# Altium project 示波器.PrjPcb
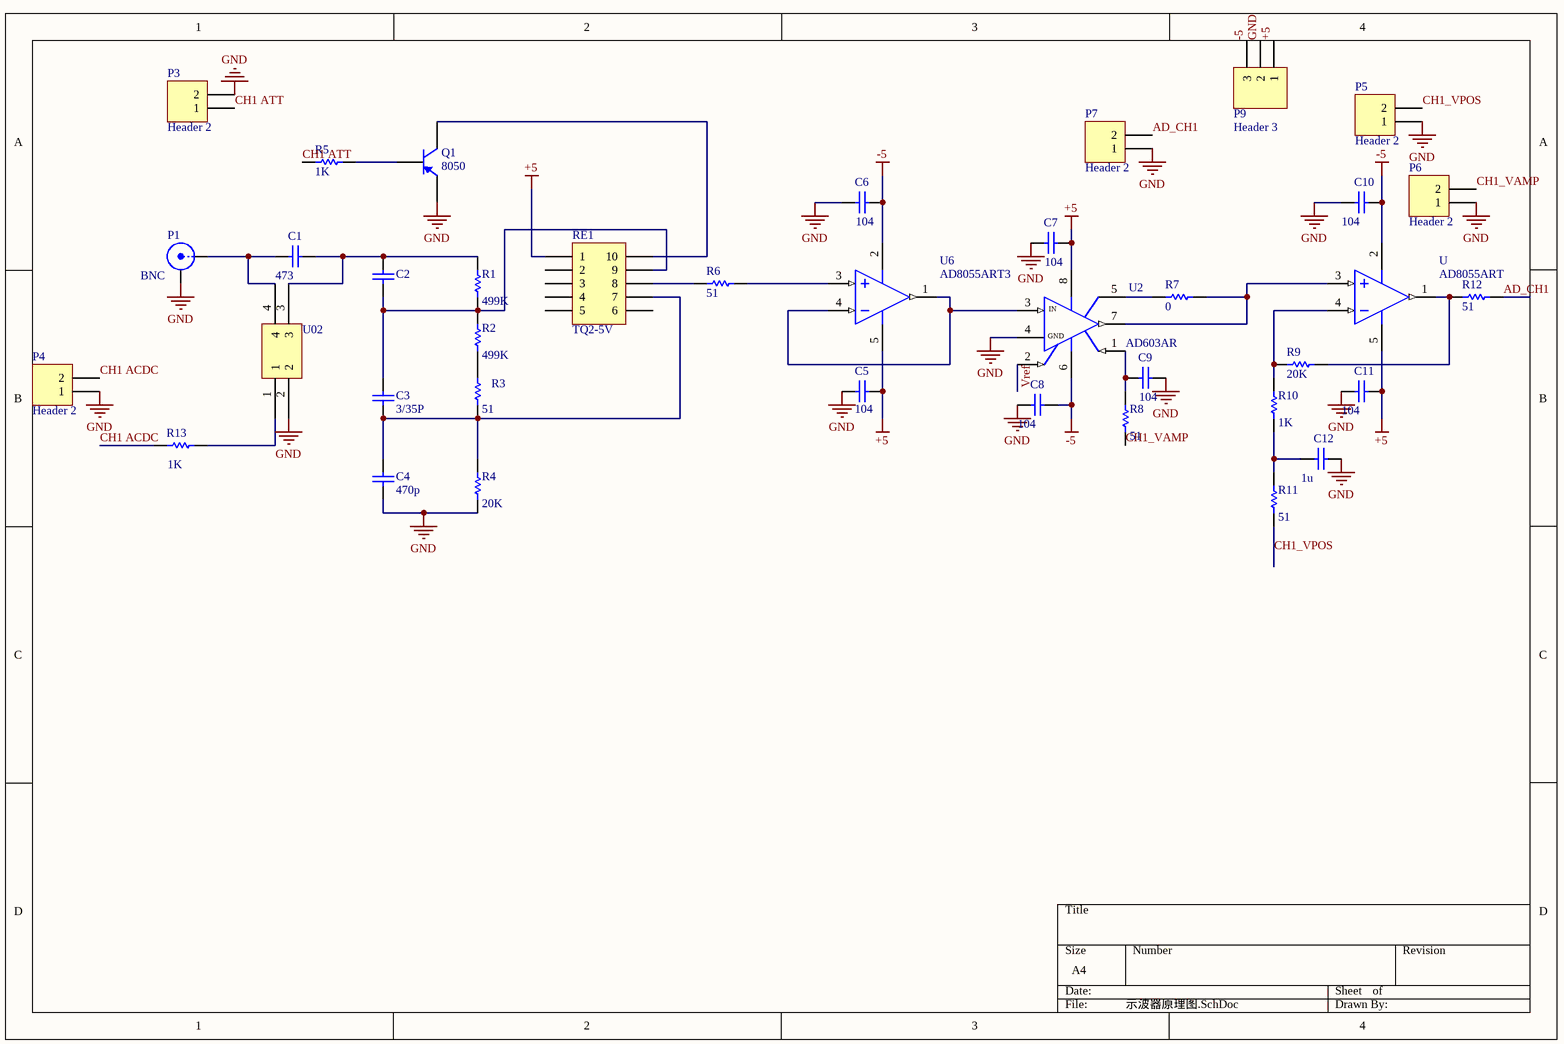
[diagram p0: 示波器原理图.SchDoc]
5 sheets, 129 parts. Net scope: global (net labels, ports and power ports of the same name join across sheets).
Board file: new示波器pcb.PcbDoc
Sheets:
  示波器原理图.SchDoc
  示波器原理图2.SchDoc
  示波器原理图6.SchDoc
  示波器原理图3.SchDoc
  示波器原理图5.SchDoc

## Sheet 示波器原理图.SchDoc
size A4

### Parts
C1  value 473  [PCBComponent_1]
C2  (no value)  [PCBComponent_1]
C3  value 3/35P  [PCBComponent_1]
C4  value 470p  [PCBComponent_1]
C5  value 104  [PCBComponent_1]
C6  104  [PCBComponent_1]
C7  value 104  [PCBComponent_1]
C8  value 104  [PCBComponent_1]
C9  value 104  [PCBComponent_1]
C10  value 104  [PCBComponent_1]
C11  value 104  [PCBComponent_1]
C12  value 1u  [PCBComponent_1]
P1  BNC  [BNC_RA CON]
P3  Header 2  [HDR1X2]
P4  Header 2  [HDR1X2]
P5  Header 2  [HDR1X2]
P6  Header 2  [HDR1X2]
P7  Header 2  [HDR1X2]
P9  Header 3  [HDR1X3]
Q1  8050  [PCBComponent_1]
R1  value 499K  [PCBComponent_1]
R2  value 499K  [PCBComponent_1]
R3  value 51  [PCBComponent_1]
R4  value 20K  [2012[0805]]
R5  value 1K  [PCBComponent_1]
R6  value 51  [PCBComponent_1]
R7  value 0  [2012[0805]]
R8  value 51  [2012[0805]]
R9  value 20K  [2012[0805]]
R10  value 1K  [2012[0805]]
R11  value 51  [2012[0805]]
R12  value 51  [2012[0805]]
R13  value 1K  [PCBComponent_1]
RE1  TQ2-5V  [PCBComponent_1]
U  AD8055ART  [SOT95P245X110-5N]
U2  AD603AR  [SOIC127P600X175-8N]
U02  (no value)  [SOP254P610X218-4N]
U6  AD8055ART3  [SOT95P245X110-5N]

### Nets
+5: C5.1 C7.2 C11.2 P9.1 RE1.1 U.5(V+) U2.8(V+) U6.5(V+)
-5: C6.1 C8.2 C10.2 P9.3 U.2(V-) U2.6(V-) U6.2(V-)
GND: C4.1 C5.2 C6.2 C7.1 C8.1 C9.2 C10.1 C11.1 C12.2 P1.2(Y) P3.2 P4.1 P5.1 P6.1 P7.1 P9.2 Q1.1(E) R4.1 U02.2 U2.4(COMM)
AD_CH1: P7.2 R12.1
CH1 ACDC: P4.2 R13.1
CH1 ATT: P3.1 R5.2
CH1_VAMP: P6.2 R8.1
CH1_VPOS: P5.2 R11.1
Vref: U2.2(G-)
NetC1_1: C1.1 P1.1(X) U02.4
NetC1_2: C1.2 C2.2 R1.2 U02.3
NetC2_1: C2.1 C3.2 R1.1 R2.2 RE1.9
NetC3_1: C3.1 C4.2 R3.1 R4.2 RE1.7
NetC9_1: C9.1 R8.2 U2.1(G+)
NetC12_1: C12.1 R10.1 R11.2
NetQ1_2: Q1.2(B) R5.1
NetQ1_3: Q1.3(C) RE1.10
NetR2_1: R2.1 R3.2
NetR6_1: R6.1 U6.3(IN+)
NetR6_2: R6.2 RE1.8
NetR7_1: R7.1 U.3(IN+) U2.7(VOUT)
NetR7_2: R7.2 U2.5(FDBK)
NetR9_1: R9.1 R12.2 U.1(OUT)
NetR9_2: R9.2 R10.2 U.4(IN-)
NetR13_2: R13.2 U02.1
NetU2_3: U2.3(VINP) U6.1(OUT) U6.4(IN-)

Not connected (* = marked no-connect by the designer): RE1 2 3 4 5 6

### Notes on the sheet
- (in symbol AD603AR) IN; GND

### Library data of the parts
C1-C12 = Cap: Capacitor; Published: 8-Jun-2000; LatestRevisionDate: 17-Jul-2002; LatestRevisionNote: Re-released for DXP Platform.; PackageReference: RAD-0.3; Publisher: Altium Limited
P1 = BNC: BNC Elbow Connector; LatestRevisionDate: 17-Jul-2002; LatestRevisionNote: Re-released for DXP Platform.; Publisher: Altium Limited
P3-P7 = Header 2: Header, 2-Pin; LatestRevisionDate: 17-Jul-2002; LatestRevisionNote: Re-released for DXP Platform.; Publisher: Altium Limited
P9 = Header 3: Header, 3-Pin; LatestRevisionDate: 17-Jul-2002; LatestRevisionNote: Re-released for DXP Platform.; Publisher: Altium Limited
Q1 = 2N3906: PNP General Purpose Amplifier; Published: 8-Jun-2000; LatestRevisionDate: 15-Jan-2003; LatestRevisionNote: PCB Footprint 'BCY-W3/D4.7' replaced; DatasheetDocument: 1997; PackageDocument: Sep-1998; PackageReference: TO-92A; Publisher: Altium Limited; Code_JEDEC: TO-92A; ComponentLink1Description: Manufacturer Link; ComponentLink1URL: http://www.fairchildsemi.com/; ComponentLink2Description: Datasheet; ComponentLink2URL: http://www.fairchildsemi.com/ds/2N%2F2N3906.pdf
R1-R3 R5 R6 R13 = Res1: Resistor; Published: 8-Jun-2000; LatestRevisionDate: 17-Jul-2002; LatestRevisionNote: Re-released for DXP Platform.; PackageReference: AXIAL-0.3; Publisher: Altium Limited
R4 R7-R12 = Res Semi: Semiconductor Resistor; Published: 8-Jun-2000; LatestRevisionDate: 17-Jul-2002; LatestRevisionNote: Re-released for DXP Platform.; PackageReference: AXIAL-0.5; Publisher: Altium Limited
RE1 U02 = Component_1
U U6 = AD8055ART: Low Cost, 300MHz Voltage Feedback Amplifier; Text Field7: Published 8-Jun-2000
U2 = AD603AR: Low-Noise, 90MHz Variable Gain Amplifier; Text Field7: Published 8-Jun-2000, Modified 10-July-2000: SIM Model Added.

## Sheet 示波器原理图2.SchDoc
size A4
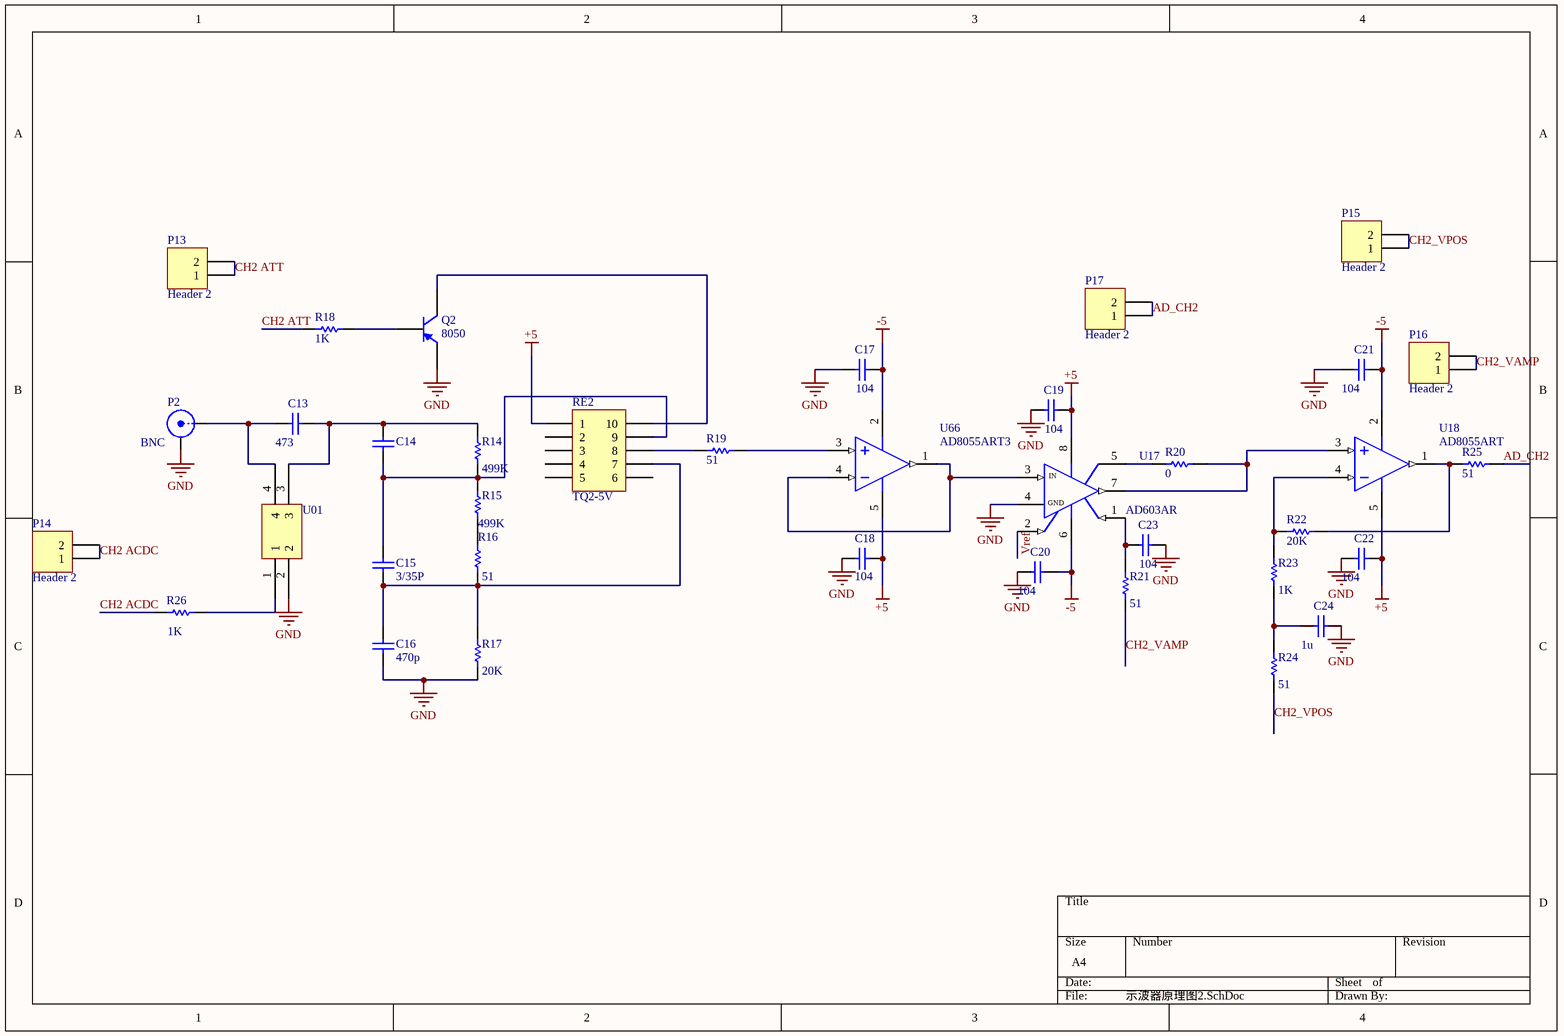
[diagram p1: 示波器原理图2.SchDoc]

### Parts
C13  value 473  [PCBComponent_1]
C14  (no value)  [PCBComponent_1]
C15  value 3/35P  [PCBComponent_1]
C16  value 470p  [PCBComponent_1]
C17  104  [PCBComponent_1]
C18  value 104  [PCBComponent_1]
C19  value 104  [PCBComponent_1]
C20  value 104  [PCBComponent_1]
C21  value 104  [PCBComponent_1]
C22  value 104  [PCBComponent_1]
C23  value 104  [PCBComponent_1]
C24  value 1u  [PCBComponent_1]
P2  BNC  [BNC_RA CON]
P13  Header 2  [HDR1X2]
P14  Header 2  [HDR1X2]
P15  Header 2  [HDR1X2]
P16  Header 2  [HDR1X2]
P17  Header 2  [HDR1X2]
Q2  8050  [PCBComponent_1]
R14  value 499K  [PCBComponent_1]
R15  value 499K  [PCBComponent_1]
R16  value 51  [PCBComponent_1]
R17  value 20K  [2012[0805]]
R18  value 1K  [PCBComponent_1]
R19  value 51  [PCBComponent_1]
R20  value 0  [2012[0805]]
R21  value 51  [2012[0805]]
R22  value 20K  [2012[0805]]
R23  value 1K  [2012[0805]]
R24  value 51  [2012[0805]]
R25  value 51  [2012[0805]]
R26  value 1K  [PCBComponent_1]
RE2  TQ2-5V  [PCBComponent_1]
U01  (no value)  [SOP254P610X218-4N]
U17  AD603AR  [SOIC127P600X175-8N]
U18  AD8055ART  [SOT95P245X110-5N]
U66  AD8055ART3  [SOT95P245X110-5N]

### Nets
+5: C18.1 C19.2 C22.2 RE2.1 U17.8(V+) U18.5(V+) U66.5(V+)
-5: C17.1 C20.2 C21.2 U17.6(V-) U18.2(V-) U66.2(V-)
GND: C16.1 C17.2 C18.2 C19.1 C20.1 C21.1 C22.1 C23.2 C24.2 P2.2(Y) Q2.1(E) R17.1 U01.2 U17.4(COMM)
AD_CH2: P17.1 P17.2 R25.1
CH2 ACDC: P14.1 P14.2 R26.1
CH2 ATT: P13.1 P13.2 R18.2
CH2_VAMP: P16.1 P16.2 R21.1
CH2_VPOS: P15.1 P15.2 R24.1
Vref: U17.2(G-)
NetC13_1: C13.1 P2.1(X) U01.4
NetC13_2: C13.2 C14.2 R14.2 U01.3
NetC14_1: C14.1 C15.2 R14.1 R15.2 RE2.9
NetC15_1: C15.1 C16.2 R16.1 R17.2 RE2.7
NetC23_1: C23.1 R21.2 U17.1(G+)
NetC24_1: C24.1 R23.1 R24.2
NetQ2_2: Q2.2(B) R18.1
NetQ2_3: Q2.3(C) RE2.10
NetR15_1: R15.1 R16.2
NetR19_1: R19.1 U66.3(IN+)
NetR19_2: R19.2 RE2.8
NetR20_1: R20.1 U17.7(VOUT) U18.3(IN+)
NetR20_2: R20.2 U17.5(FDBK)
NetR22_1: R22.1 R25.2 U18.1(OUT)
NetR22_2: R22.2 R23.2 U18.4(IN-)
NetR26_2: R26.2 U01.1
NetU17_3: U17.3(VINP) U66.1(OUT) U66.4(IN-)

Not connected (* = marked no-connect by the designer): RE2 2 3 4 5 6

### Notes on the sheet
- (in symbol AD603AR) IN; GND

### Library data of the parts
C13-C24 = Cap: Capacitor; Published: 8-Jun-2000; LatestRevisionDate: 17-Jul-2002; LatestRevisionNote: Re-released for DXP Platform.; PackageReference: RAD-0.3; Publisher: Altium Limited
P2 = BNC: BNC Elbow Connector; LatestRevisionDate: 17-Jul-2002; LatestRevisionNote: Re-released for DXP Platform.; Publisher: Altium Limited
P13-P17 = Header 2: Header, 2-Pin; LatestRevisionDate: 17-Jul-2002; LatestRevisionNote: Re-released for DXP Platform.; Publisher: Altium Limited
Q2 = 2N3906: PNP General Purpose Amplifier; Published: 8-Jun-2000; LatestRevisionDate: 15-Jan-2003; LatestRevisionNote: PCB Footprint 'BCY-W3/D4.7' replaced; DatasheetDocument: 1997; PackageDocument: Sep-1998; PackageReference: TO-92A; Publisher: Altium Limited; Code_JEDEC: TO-92A; ComponentLink1Description: Manufacturer Link; ComponentLink1URL: http://www.fairchildsemi.com/; ComponentLink2Description: Datasheet; ComponentLink2URL: http://www.fairchildsemi.com/ds/2N%2F2N3906.pdf
R14-R16 R18 R19 R26 = Res1: Resistor; Published: 8-Jun-2000; LatestRevisionDate: 17-Jul-2002; LatestRevisionNote: Re-released for DXP Platform.; PackageReference: AXIAL-0.3; Publisher: Altium Limited
R17 R20-R25 = Res Semi: Semiconductor Resistor; Published: 8-Jun-2000; LatestRevisionDate: 17-Jul-2002; LatestRevisionNote: Re-released for DXP Platform.; PackageReference: AXIAL-0.5; Publisher: Altium Limited
RE2 U01 = Component_1
U17 = AD603AR: as U2 on sheet 示波器原理图
U18 U66 = AD8055ART: as U on sheet 示波器原理图

## Sheet 示波器原理图6.SchDoc
size A4
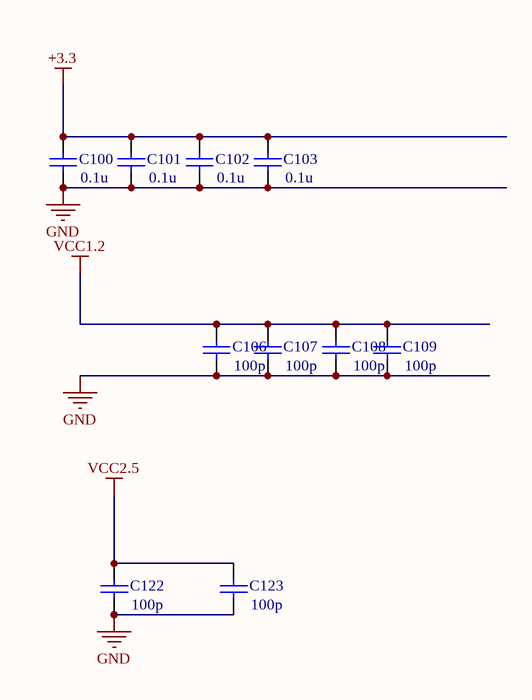
[diagram p2: 示波器原理图6.SchDoc]

### Parts
C100  value 0.1u  [PCBComponent_1]
C101  value 0.1u  [PCBComponent_1]
C102  value 0.1u  [PCBComponent_1]
C103  value 0.1u  [PCBComponent_1]
C106  value 100p  [PCBComponent_1]
C107  value 100p  [PCBComponent_1]
C108  value 100p  [PCBComponent_1]
C109  value 100p  [PCBComponent_1]
C122  value 100p  [PCBComponent_1]
C123  value 100p  [PCBComponent_1]

### Nets
+3.3: C100.2 C101.2 C102.2 C103.2
GND: C100.1 C101.1 C102.1 C103.1 C106.1 C107.1 C108.1 C109.1 C122.1 C123.1
VCC1.2: C106.2 C107.2 C108.2 C109.2
VCC2.5: C122.2 C123.2

### Library data of the parts
C100-C103 C106-C109 C122 C123 = Cap Semi: Capacitor (Semiconductor SIM Model); Published: 8-Jun-2000; LatestRevisionDate: 17-Jul-2002; LatestRevisionNote: Re-released for DXP Platform.; PackageReference: C1206; Publisher: Altium Limited

## Sheet 示波器原理图3.SchDoc
size A4
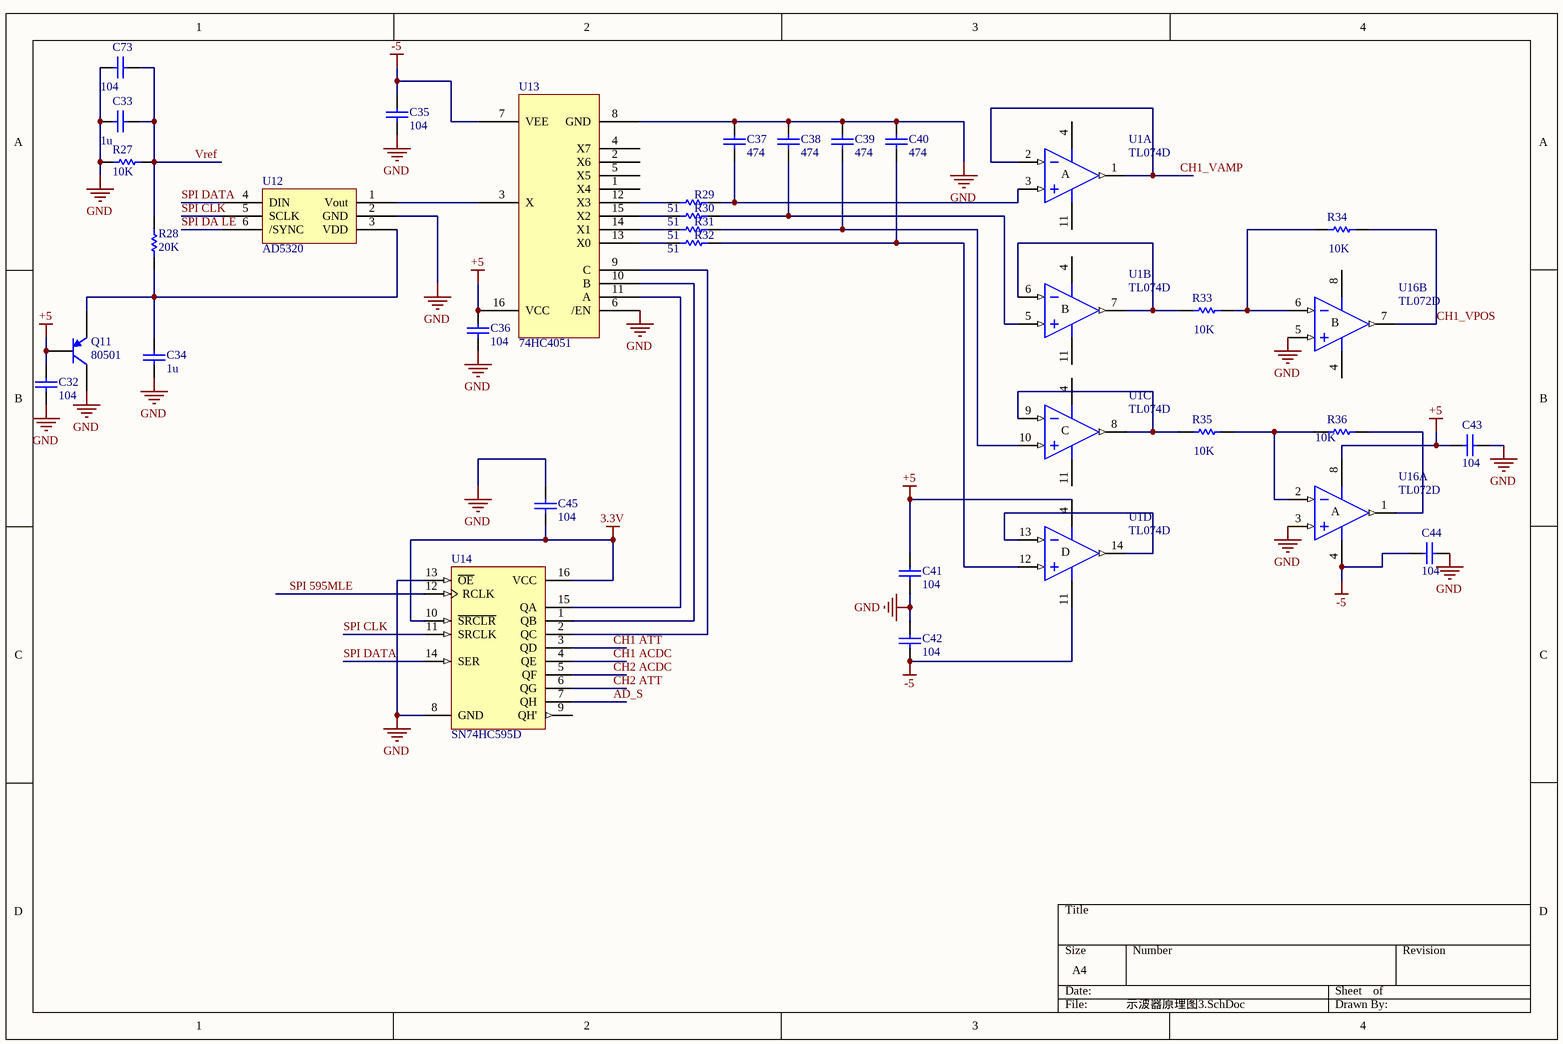
[diagram p3: 示波器原理图3.SchDoc]

### Parts
C32  value 104  [PCBComponent_1]
C33  value 1u  [PCBComponent_1]
C34  value 1u  [PCBComponent_1]
C35  value 104  [PCBComponent_1]
C36  value 104  [PCBComponent_1]
C37  value 474  [PCBComponent_1]
C38  value 474  [PCBComponent_1]
C39  value 474  [PCBComponent_1]
C40  value 474  [PCBComponent_1]
C41  value 104  [PCBComponent_1]
C42  value 104  [PCBComponent_1]
C43  value 104  [PCBComponent_1]
C44  value 104  [PCBComponent_1]
C45  value 104  [PCBComponent_1]
C73  value 104  [PCBComponent_1]
Q11  80501  [PCBComponent_1]
R27  value 10K  [PCBComponent_1]
R28  value 20K  [PCBComponent_1]
R29  51  [2012[0805]]
R30  51  [2012[0805]]
R31  51  [2012[0805]]
R32  51  [2012[0805]]
R33  value 10K  [2012[0805]]
R34  value 10K  [2012[0805]]
R35  value 10K  [2012[0805]]
R36  value 10K  [2012[0805]]
U1  TL074D  [SOP127P600X175-14N]  (parts A,B,C,D of 4)
U12  AD5320  [SOT86P280X110-6N]
U13  74HC4051  [SOP127P600X175-16N]
U14  SN74HC595D  [SOP127P600X175-16N]
U16  TL072D  [SOP127P600X175-8N]  (parts A,B of 2)

### Nets
3.3V: C45.1 U14.10(~{SRCLR}) U14.16(VCC)
+5: C32.2 C36.2 C41.1 C43.1 Q11.2(B) U1.4(V+) U13.16(VCC) U16.8(V+)
-5: C35.2 C42.2 C44.1 U1.11(V-) U13.7(VEE) U16.4(V-)
GND: C32.1 C33.1 C34.1 C35.1 C36.1 C37.2 C38.2 C39.2 C40.2 C41.2 C42.1 C43.2 C44.2 C45.2 C73.1 Q11.3(C) R27.2 U12.2(GND) U13.6(/EN) U13.8(GND) U14.8(GND) U14.13(~{OE}) U16.3(IN+) U16.5(IN+)
AD_S: U14.7(QH)
CH1 ACDC: U14.4(QE)
CH1 ATT: U14.3(QD)
CH1_VAMP: U1.1(OUT) U1.2(IN-)
CH1_VPOS: R34.2 U16.7(OUT)
CH2 ACDC: U14.5(QF)
CH2 ATT: U14.6(QG)
SPI 595MLE: U14.12(RCLK)
SPI CLK: U12.5(SCLK) U14.11(SRCLK)
SPI DA LE: U12.6(/SYNC)
SPI DATA: U12.4(DIN) U14.14(SER)
Vref: C33.2 C73.2 R27.1 R28.1
NetC34_2: C34.2 Q11.1(E) R28.2 U12.3(VDD)
NetC37_1: C37.1 R29.2 U1.3(IN+)
NetC38_1: C38.1 R30.2 U1.5(IN+)
NetC39_1: C39.1 R31.2 U1.10(IN+)
NetC40_1: C40.1 R32.2 U1.12(IN+)
NetR29_1: R29.1 U13.12(X3)
NetR30_1: R30.1 U13.15(X2)
NetR31_1: R31.1 U13.14(X1)
NetR32_1: R32.1 U13.13(X0)
NetR33_1: R33.1 U1.6(IN-) U1.7(OUT)
NetR33_2: R33.2 R34.1 U16.6(IN-)
NetR35_1: R35.1 U1.8(OUT) U1.9(IN-)
NetR35_2: R35.2 R36.1 U16.2(IN-)
NetR36_2: R36.2 U16.1(OUT)
NetU1_13: U1.13(IN-) U1.14(OUT)
NetU12_1: U12.1(Vout) U13.3(X)
NetU13_9: U13.9(C) U14.2(QC)
NetU13_10: U13.10(B) U14.1(QB)
NetU13_11: U13.11(A) U14.15(QA)

Not connected (* = marked no-connect by the designer): U13 1(X4) 2(X6) 4(X7) 5(X5); U14 9(QH')

### Notes on the sheet
- (in symbol TL072D, part A) A
- (in symbol TL072D, part B) B
- (in symbol TL074D, part A) A
- (in symbol TL074D, part B) B
- (in symbol TL074D, part C) C
- (in symbol TL074D, part D) D

### Library data of the parts
C32-C45 C73 = Cap: Capacitor; Published: 8-Jun-2000; LatestRevisionDate: 17-Jul-2002; LatestRevisionNote: Re-released for DXP Platform.; PackageReference: RAD-0.3; Publisher: Altium Limited
Q11 = 2N3906: PNP General Purpose Amplifier; Published: 8-Jun-2000; LatestRevisionDate: 15-Jan-2003; LatestRevisionNote: PCB Footprint 'BCY-W3/D4.7' replaced; DatasheetDocument: 1997; PackageDocument: Sep-1998; PackageReference: TO-92A; Publisher: Altium Limited; Code_JEDEC: TO-92A; ComponentLink1Description: Manufacturer Link; ComponentLink1URL: http://www.fairchildsemi.com/; ComponentLink2Description: Datasheet; ComponentLink2URL: http://www.fairchildsemi.com/ds/2N%2F2N3906.pdf
R27 R28 = Res1: Resistor; Published: 8-Jun-2000; LatestRevisionDate: 17-Jul-2002; LatestRevisionNote: Re-released for DXP Platform.; PackageReference: AXIAL-0.3; Publisher: Altium Limited
R29-R36 = Res Semi: Semiconductor Resistor; Published: 8-Jun-2000; LatestRevisionDate: 17-Jul-2002; LatestRevisionNote: Re-released for DXP Platform.; PackageReference: AXIAL-0.5; Publisher: Altium Limited
U1 = TL074D: Low-Noise JFET-Input Operational Amplifier; Published: 16-Jan-2001; LatestRevisionDate: 13-Apr-2006; LatestRevisionNote: IPC-7351 Footprint Added.; DatasheetVersion: Aug-1996; PackageVersion: Jan-1998; PackageReference: D014; Publisher: Altium Limited; PackageDescription: 14-Pin Small Outline Integrated Circuit 1.27 mm Pitch; Code_IPC: SOIC127P600-14; ComponentLink1Description: Manufacturer Link; ComponentLink1URL: http://www.ti.com/; ComponentLink2Description: Datasheet; ComponentLink2URL: http://www-s.ti.com/sc/ds/tl074.pdf
U12 U13 = Component_1
U14 = SN74HC595D: 8-Bit Shift Register with 3-State Output Registers; Published: 8-Jun-2000; LatestRevisionDate: 13-Apr-2006; LatestRevisionNote: IPC-7351 Footprint Added.; DatasheetVersion: May-1997; PackageVersion: Jan-1998; PackageReference: D016; Publisher: Altium Limited; PackageDescription: 16-Pin Small Outline Integrated Circuit 1.27 mm Pitch; Code_IPC: SOIC127P600-16; ComponentLink1Description: Manufacturer Link; ComponentLink1URL: http://www.ti.com/; ComponentLink2Description: Datasheet; ComponentLink2URL: http://www-s.ti.com/sc/ds/sn74hc595.pdf
U16 = TL072D: Low-Noise JFET-Input Operational Amplifier; Published: 16-Jan-2001; LatestRevisionDate: 13-Apr-2006; LatestRevisionNote: IPC-7351 Footprint Added.; DatasheetVersion: Aug-1996; PackageVersion: Jan-1998; PackageReference: D008; Publisher: Altium Limited; PackageDescription: 8-Pin Small Outline Integrated Circuit 1.27 mm Pitch; Code_IPC: SOIC127P600-8; ComponentLink1Description: Manufacturer Link; ComponentLink1URL: http://www.ti.com/; ComponentLink2Description: Datasheet; ComponentLink2URL: http://www-s.ti.com/sc/ds/tl072.pdf

## Sheet 示波器原理图5.SchDoc
size A4
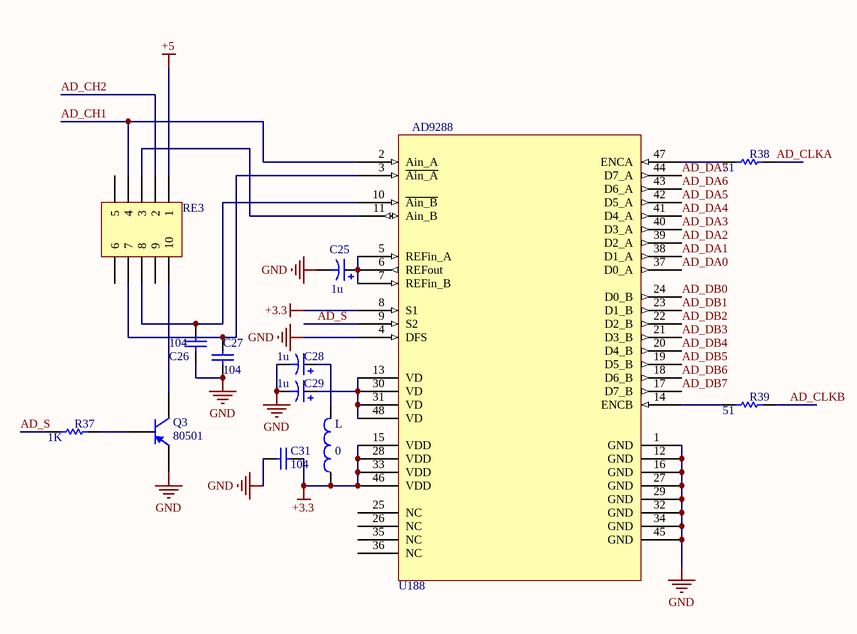
[diagram p4: 示波器原理图5.SchDoc]

### Parts
C25  value 1u  [C0805]
C26  value 104  [PCBComponent_1]
C27  value 104  [PCBComponent_1]
C28  value 1u  [C0805]
C29  value 1u  [C0805]
C31  value 104  [PCBComponent_1]
L  value 0  [L0603]
Q3  80501  [PCBComponent_1]
R37  1K  [2012[0805]]
R38  51  [2012[0805]]
R39  51  [2012[0805]]
RE3  (no value)  [PCBComponent_1]
U188  (no value)  [TSQFP50P900X900X160-48N]

### Nets
+3.3: C31.1 L.1 U188.8(S1) U188.15(VDD) U188.28(VDD) U188.33(VDD) U188.46(VDD)
+5: RE3.1
GND: C25.2 C26.2 C27.2 C28.2 C29.2 C31.2 Q3.1(E) U188.1(GND) U188.4(DFS) U188.12(GND) U188.16(GND) U188.27(GND) U188.29(GND) U188.32(GND) U188.34(GND) U188.45(GND)
AD_CH1: RE3.4 U188.2(Ain_A)
AD_CH2: RE3.2
AD_CLKA: R38.2
AD_CLKB: R39.2
AD_DA0: U188.37(D0_A)
AD_DA1: U188.38(D1_A)
AD_DA2: U188.39(D2_A)
AD_DA3: U188.40(D3_A)
AD_DA4: U188.41(D4_A)
AD_DA5: U188.42(D5_A)
AD_DA6: U188.43(D6_A)
AD_DA7: U188.44(D7_A)
AD_DB0: U188.24(D0_B)
AD_DB1: U188.23(D1_B)
AD_DB2: U188.22(D2_B)
AD_DB3: U188.21(D3_B)
AD_DB4: U188.20(D4_B)
AD_DB5: U188.19(D5_B)
AD_DB6: U188.18(D6_B)
AD_DB7: U188.17(D7_B)
AD_S: R37.1 U188.9(S2)
NetC25_1: C25.1 U188.5(REFin_A) U188.6(REFout) U188.7(REFin_B)
NetC26_1: C26.1 RE3.8 U188.10(~{Ain_B})
NetC27_1: C27.1 RE3.7 U188.3(~{Ain_A})
NetC28_1: C28.1 L.2
NetC29_1: C29.1 U188.13(VD) U188.30(VD) U188.31(VD) U188.48(VD)
NetQ3_2: Q3.2(B) R37.2
NetQ3_3: Q3.3(C) RE3.10
NetR38_1: R38.1 U188.47(ENCA)
NetR39_1: R39.1 U188.14(ENCB)
NetRE3_3: RE3.3 U188.11(Ain_B)

Not connected (* = marked no-connect by the designer): RE3 5 6 9; U188 25(NC) 26(NC) 35(NC) 36(NC)

### Notes on the sheet
- (in symbol Component_1) AD9288

### Library data of the parts
C25 C28 C29 = Cap Pol3: Polarized Capacitor (Surface Mount); Published: 8-Jun-2000; LatestRevisionDate: 17-Jul-2002; LatestRevisionNote: Re-released for DXP Platform.; PackageReference: C0805; Publisher: Altium Limited
C26 C27 C31 = Cap: Capacitor; Published: 8-Jun-2000; LatestRevisionDate: 17-Jul-2002; LatestRevisionNote: Re-released for DXP Platform.; PackageReference: RAD-0.3; Publisher: Altium Limited
L = Inductor: Code_IEC: 1005; Published: 8-Jun-2000; LatestRevisionDate: 17-Jul-2002; LatestRevisionNote: Re-released for DXP Platform.; PackageReference: 0402-A; Publisher: Altium Limited; Code_JEITA: 0402
Q3 = 2N3906: PNP General Purpose Amplifier; Published: 8-Jun-2000; LatestRevisionDate: 15-Jan-2003; LatestRevisionNote: PCB Footprint 'BCY-W3/D4.7' replaced; DatasheetDocument: 1997; PackageDocument: Sep-1998; PackageReference: TO-92A; Publisher: Altium Limited; Code_JEDEC: TO-92A; ComponentLink1Description: Manufacturer Link; ComponentLink1URL: http://www.fairchildsemi.com/; ComponentLink2Description: Datasheet; ComponentLink2URL: http://www.fairchildsemi.com/ds/2N%2F2N3906.pdf
R37-R39 = Res Semi: Semiconductor Resistor; Published: 8-Jun-2000; LatestRevisionDate: 17-Jul-2002; LatestRevisionNote: Re-released for DXP Platform.; PackageReference: AXIAL-0.5; Publisher: Altium Limited
RE3 U188 = Component_1

## Nets that join several sheets
+3.3: 示波器原理图6 (C100.2 C101.2 C102.2 C103.2), 示波器原理图5 (7 pins)
+5: 示波器原理图 (8 pins), 示波器原理图2 (7 pins), 示波器原理图3 (8 pins), 示波器原理图5 (RE3.1)
-5: 示波器原理图 (7 pins), 示波器原理图2 (6 pins), 示波器原理图3 (6 pins)
GND: 示波器原理图 (20 pins), 示波器原理图2 (14 pins), 示波器原理图6 (10 pins), 示波器原理图3 (24 pins), 示波器原理图5 (16 pins)
AD_CH1: 示波器原理图 (P7.2 R12.1), 示波器原理图5 (RE3.4 U188.2)
AD_CH2: 示波器原理图2 (P17.1 P17.2 R25.1), 示波器原理图5 (RE3.2)
AD_S: 示波器原理图3 (U14.7), 示波器原理图5 (R37.1 U188.9)
CH1 ACDC: 示波器原理图 (P4.2 R13.1), 示波器原理图3 (U14.4)
CH1 ATT: 示波器原理图 (P3.1 R5.2), 示波器原理图3 (U14.3)
CH1_VAMP: 示波器原理图 (P6.2 R8.1), 示波器原理图3 (U1.1 U1.2)
CH1_VPOS: 示波器原理图 (P5.2 R11.1), 示波器原理图3 (R34.2 U16.7)
CH2 ACDC: 示波器原理图2 (P14.1 P14.2 R26.1), 示波器原理图3 (U14.5)
CH2 ATT: 示波器原理图2 (P13.1 P13.2 R18.2), 示波器原理图3 (U14.6)
Vref: 示波器原理图 (U2.2), 示波器原理图2 (U17.2), 示波器原理图3 (C33.2 C73.2 R27.1 R28.1)